# EAGLE design CrsHamPreamp (EAGLE 5.11)
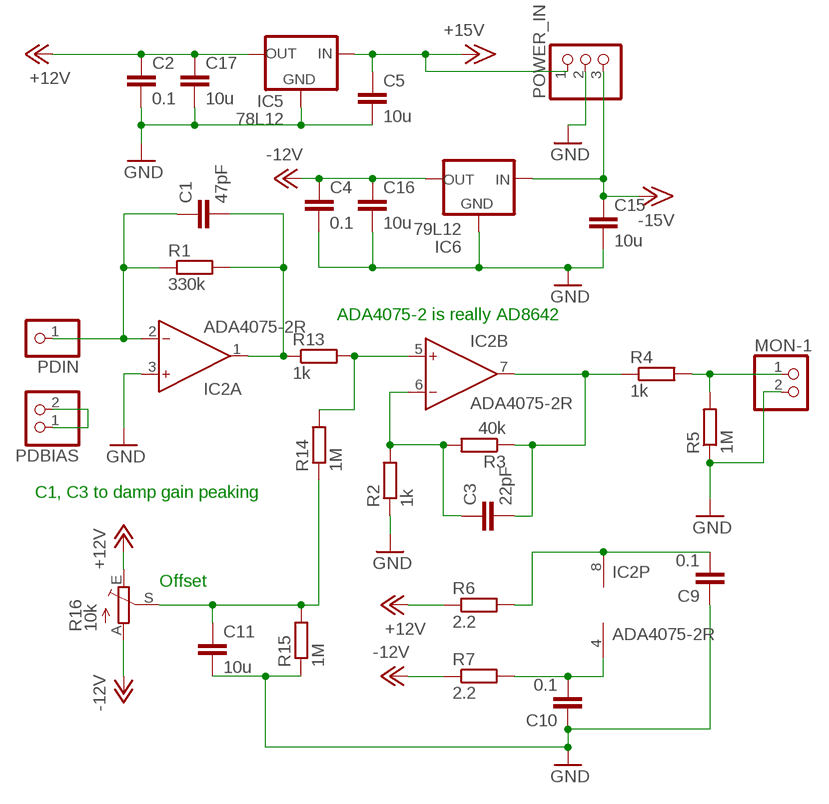
[diagram p0: schematic, sheet 1]

## Parts
C1  47pF  C-EUC0805  [C0805]
C2  0.1  C-EUC1206  [C1206]
C3  22pF  C-EUC0805  [C0805]
C4  0.1  C-EUC1206  [C1206]
C5  10u  C-EUC1206  [C1206]
C9  0.1  C-EUC0805  [C0805]
C10  0.1  C-EUC0805  [C0805]
C11  10u  C-EUC1206  [C1206]
C15  10u  C-EUC1206  [C1206]
C16  10u  C-EUC1206  [C1206]
C17  10u  C-EUC1206  [C1206]
IC2  ADA4075-2R  [SO8]
IC5  78L12  78LXX  [78LXX]
IC6  79L12  79LXX  [79LXX]
MON-1  PINHD-1X2  [1X02]
PDBIAS  PINHD-1X2  [1X02]
PDIN  PINHD-1X1  [1X01]
POWER_IN  PINHD-1X3  [1X03]
R1  330k  R-EU_R0805  [R0805]
R2  1k  R-EU_R0805  [R0805]
R3  40k  R-EU_R0805  [R0805]
R4  1k  R-EU_R0805  [R0805]
R5  1M  R-EU_R0805  [R0805]
R6  2.2  R-EU_R0805  [R0805]
R7  2.2  R-EU_R0805  [R0805]
R13  1k  R-EU_R0805  [R0805]
R14  1M  R-EU_R0805  [R0805]
R15  1M  R-EU_R0805  [R0805]
R16  10k  TRIM_EU-S63P  [S63P]

## Nets
+12V: C2.1 C17.1 IC5.OUT R6.1 R16.E
+15V: C5.1 IC5.IN POWER_IN.1
-12V: C4.1 C16.1 IC6.OUT R7.1 R16.A
-15V: C15.1 IC6.IN POWER_IN.3
GND: C2.2 C4.2 C5.2 C9.1 C10.1 C11.2 C15.2 C16.2 C17.2 IC2.3(A:IN+) IC5.GND IC6.GND MON-1.2 POWER_IN.2 R2.1 R5.1 R15.1
N$1: C1.1 IC2.2(A:IN-) PDIN.1 R1.1
N$2: C1.2 IC2.1(A:OUT) R1.2 R13.1
N$3: MON-1.1 R4.2 R5.2
N$4: C10.2 IC2.4(P:V-) R7.2
N$6: C9.2 IC2.8(P:V+) R6.2
N$7: C3.2 IC2.7(B:OUT) R3.1 R4.1
N$11: PDBIAS.1 PDBIAS.2
N$16: IC2.5(B:IN+) R13.2 R14.2
N$17: C3.1 IC2.6(B:IN-) R2.2 R3.2
OFFSET: C11.1 R14.1 R15.2 R16.S

## Notes on the sheet
- ADA4075-2 is really AD8642
- C1, C3 to damp gain peaking
- Offset

## Library data of the parts
C1-C5 C9-C11 C15-C17 = rcl:C-EU: CAPACITOR, European symbol
IC2 = analog-devices:ADA4075-2: Ultralow Noise Amplifier at Lower Power Source: http://www.analog.com/static/imported-files/data_sheets/ADA4075-2.pdf; MPN: ADA4075-2ARZ; OC_FARNELL: 1701254; OC_NEWARK: 19P8164
IC5 = v-reg:78LXX: VOLTAGE REGULATOR
IC6 = v-reg:79LXX: VOLTAGE REGULATOR
MON-1 PDBIAS = pinhead:PINHD-1X2: PIN HEADER
PDIN = pinhead:PINHD-1X1: PIN HEADER
POWER_IN = pinhead:PINHD-1X3: PIN HEADER
R1-R7 R13-R15 = rcl:R-EU_: RESISTOR, European symbol
R16 = pot:TRIM_EU-: POTENTIOMETER

## Board
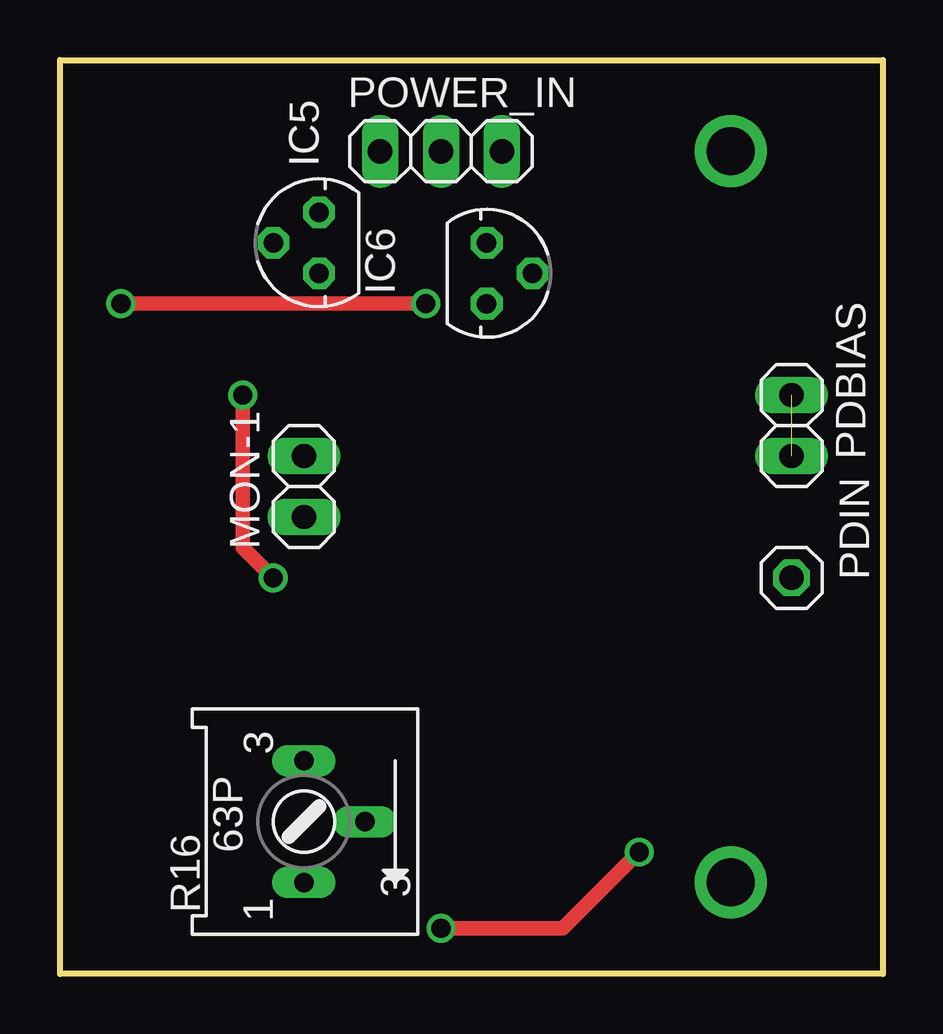
[diagram p1: board, top side]
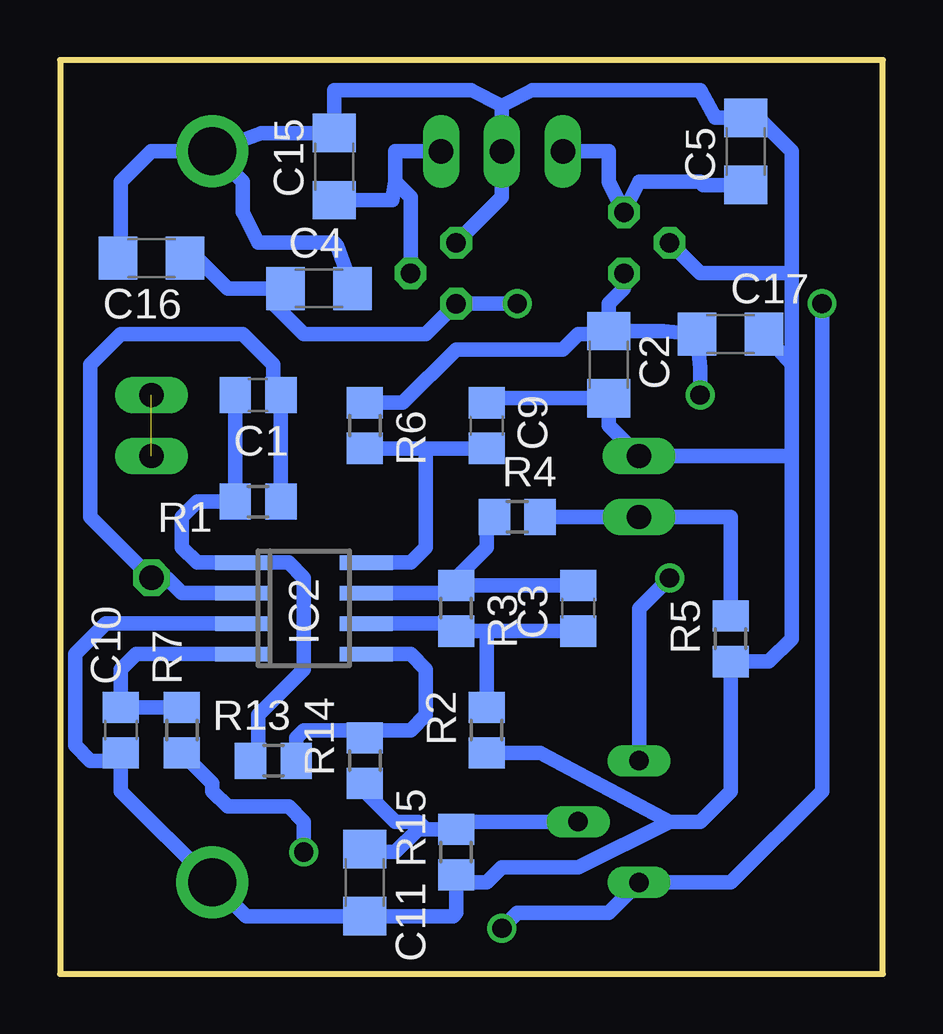
[diagram p2: board, bottom side, seen from below]

Size 34.29 x 38.1 mm. Coordinates in mm from the lower left corner, seen from the top.
Outline: 0,0 0,38.1 34.29,38.1 34.29,0 0,0
Copper layers (1*16): Top 0.035mm / dielectric 1.5mm / Bottom 0.035mm
Design rules "default": minimum track width 10mil, minimum drill 24mil, track to track 8mil, track to pad 8mil, pad to pad 8mil, via to via 8mil, smd to smd 8mil, copper to edge 40mil, drill to drill 8mil, minimum pad ring 10mil, minimum via ring 8mil, stop-mask expansion 4mil, vias tented up to drill 0mil, thermal gap 10mil

### Footprints (pad centres in the part's own frame; a part is rotated, then mirrored left to right if it is on the bottom)
C0805 = smd 1.3 x 1.5: 1 -0.95,0; 2 0.95,0
C1206 = smd 1.6 x 1.8: 1 -1.4,0; 2 1.4,0
SO8 = smd 0.6 x 2.2: 1 -1.905,-2.6; 2 -0.635,-2.6; 3 0.635,-2.6; 4 1.905,-2.6; 5 1.905,2.6; 6 0.635,2.6; 7 -0.635,2.6; 8 -1.905,2.6
78LXX = drill 0.813 octagon: GND 0,1.905; IN 1.27,0; OUT -1.27,0
79LXX = drill 0.813 octagon: GND -1.27,0; IN 0,1.905; OUT 1.27,0
1X02 = drill 1.016 long: 1 -1.27,0; 2 1.27,0
1X01 = drill 1.016 octagon: 1 0,0
1X03 = drill 1.016 long: 1 -2.54,0; 2 0,0; 3 2.54,0
R0805 = smd 1.3 x 1.5: 1 -0.95,0; 2 0.95,0
S63P = drill 0.813 long: A 2.54,0; E -2.54,0; S 0,2.54

### Placement (x,y rotation side)
C1  26.04,24.13 180 bottom
C2  11.43,25.4 270 bottom
C3  12.7,15.24 90 bottom
C4  23.5,28.58 0 bottom
C5  5.71,34.29 90 bottom
C9  16.51,22.86 270 bottom
C10  31.75,10.16 90 bottom
C11  21.59,3.81 270 bottom
C15  22.86,33.66 90 bottom
C16  30.48,29.84 180 bottom
C17  6.35,26.67 0 bottom
IC2  24.13,15.24 270 bottom
IC5  10.79,30.48 90 top
IC6  17.78,29.21 270 top
MON-1  10.16,20.32 90 top
PDBIAS  30.48,22.86 270 top
PDIN  30.48,16.51 0 top
POWER_IN  15.88,34.29 0 top
R1  26.04,19.69 180 bottom
R2  16.51,10.16 90 bottom
R3  17.78,15.24 270 bottom
R4  15.24,19.05 0 bottom
R5  6.35,13.97 90 bottom
R6  21.59,22.86 270 bottom
R7  29.21,10.16 90 bottom
R13  25.4,8.89 0 bottom
R14  21.59,8.89 90 bottom
R15  17.78,5.08 90 bottom
R16  10.16,6.35 270 top

### Tracks (layer width: path | path; a pad name or v marks a point on that pad's centre or on a via)
+12V  (via drill 0.8)
  Top 0.61: v8.89,16.51 7.62,17.78 v7.62,24.13
  Bottom 0.61: IC5.OUT 10.79,28.58 11.43,27.94 C2.1 | C2.1 9.15,26.8 C17.1 7.62,25.27 v7.62,24.13 | R6.1 20,23.81 17.78,26.04 13.34,26.04 12.7,26.67 11.56,26.67 C2.1 | R16.E 10.16,15.24 v8.89,16.51
+15V
  Bottom 0.61: C5.1 7.49,32.89 7.62,33.02 10.16,33.02 IC5.IN 11.43,33.02 11.43,34.29 POWER_IN.1
-12V  (via drill 0.8)
  Top 0.61: v2.54,27.94 v15.24,27.94 | v15.88,1.91 20.95,1.91 v24.13,5.08
  Bottom 0.61: C16.1 28.57,29.84 27.3,28.58 25.4,28.58 | 25.4,28.58 C4.1 | 25.4,28.58 25.4,27.94 24.13,26.67 19.05,26.67 IC6.OUT v15.24,27.94 | v2.54,27.94 2.54,7.62 6.35,3.81 R16.A 11.43,2.54 15.24,2.54 v15.88,1.91 | v24.13,5.08 24.13,6.35 24.77,6.99 27.3,6.99 27.94,7.62 27.94,7.94 R7.1
-15V
  Bottom 0.61: C15.1 20.45,32.26 20.32,33.02 | 20.32,33.02 20.32,34.29 POWER_IN.3 | IC6.IN 19.68,32.39 20.32,33.02
GND  (via drill 2)
  Bottom 0.61: 15.88,36.2 14.61,36.83 7.62,36.83 6.99,35.69 C5.2 5.58,35.56 5.08,35.56 3.81,34.29 3.81,29.21 | 3.81,21.59 3.81,13.97 4.76,13.02 R5.1 6.35,7.62 7.62,6.35 8.89,6.35 | 15.88,36.2 POWER_IN.2 15.88,32.39 IC6.GND | 15.88,36.2 17.14,36.83 22.86,36.83 C15.2 25.91,35.05 v27.94,34.29 | v27.94,34.29 30.48,34.29 31.75,33.02 31.75,29.98 C16.2 | C4.2 22.73,30.35 22.86,30.48 26.04,30.48 26.67,31.75 26.67,33.02 v27.94,34.29 | 3.81,21.59 MON-1.2 11.43,22.86 C2.2 16.32,24 C9.1 | 3.81,25.4 3.81,29.21 | 3.81,25.4 C17.2 | 3.81,21.59 3.81,25.4 | IC5.GND 7.62,29.21 3.81,29.21 | IC2.3 32.38,14.61 33.66,13.34 33.66,9.53 33.02,8.89 32.07,8.89 C10.1 31.75,7.62 v27.94,3.81 26.54,2.41 C11.2 17.91,2.41 17.78,2.54 R15.1 17.46,3.81 16.51,3.81 15.88,4.45 12.7,4.45 8.89,6.35 | R2.1 14.29,9.21 8.89,6.35
N$1
  Bottom 0.61: IC2.2 29.21,15.88 29.84,16.51 PDIN.1 33.02,19.05 33.02,25.4 31.75,26.67 26.67,26.67 25.4,25.4 25.4,24.45 C1.1 R1.1
N$2
  Bottom 0.61: C1.2 R1.2 28.57,19.69 29.21,19.05 29.21,17.78 28.57,17.14 IC2.1 24.77,17.14 24.13,16.51 24.13,12.7 26.04,10.79 26.04,9.21 R13.1
N$3
  Bottom 0.61: R4.2 MON-1.1 6.35,19.05 R5.2
N$4
  Bottom 0.61: IC2.4 31.11,13.34 31.75,12.7 C10.2 R7.2
N$6
  Bottom 0.61: C9.2 19.05,21.91 | 19.05,21.91 R6.2 | IC2.8 19.68,17.14 19.05,17.78 19.05,21.91
N$7
  Bottom 0.61: IC2.7 18.09,15.88 R3.1 | R3.1 17.78,16.51 16.51,17.78 16.51,18.73 R4.1 | C3.2 R3.1
N$11  (1 unrouted)
N$16
  Bottom 0.61: R13.2 24.45,9.84 24.13,10.16 21.91,10.16 R14.2 21.27,10.16 19.68,10.16 19.05,10.79 19.05,12.7 19.68,13.34 IC2.5
N$17
  Bottom 0.61: 16.51,14.29 C3.1 | 16.51,14.29 R3.2 18.09,14.61 IC2.6 | R2.2 16.51,14.29
OFFSET
  Bottom 0.61: R16.S 17.46,6.35 R15.2 19.05,6.03 | 19.05,6.03 19.37,6.03 20.32,5.08 21.46,5.08 C11.1 | R14.1 21.59,7.62 20.32,6.35 19.37,6.35 19.05,6.03